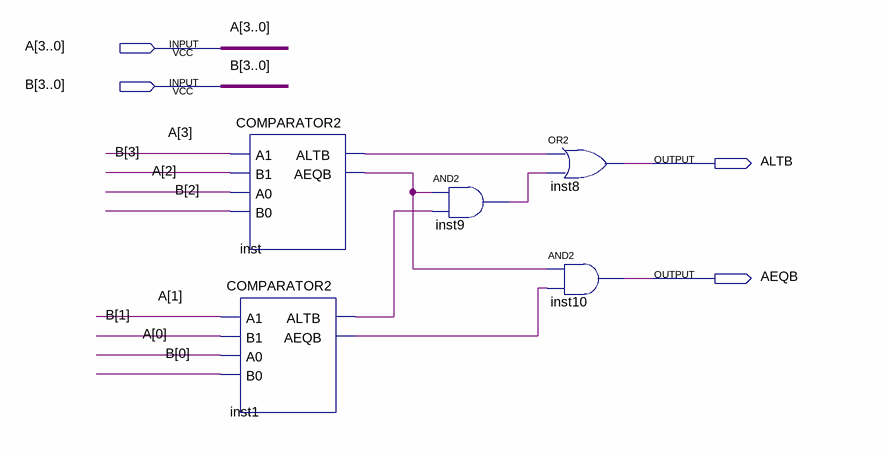
[diagram p0: schematic sheet]
// Quartus schematic COMPARATOR4-B.bdf as structural Verilog: 5 symbols, 4 pins
module \COMPARATOR4-B  (
  input  [3:0] A,
  input  [3:0] B,
  output ALTB,
  output AEQB
);

  wire inst1_aeqb, inst1_altb, inst9_out, inst_aeqb, inst_altb;

  COMPARATOR2 inst (.A1(A[3]), .B1(B[3]), .A0(A[2]), .B0(B[2]), .ALTB(inst_altb), .AEQB(inst_aeqb));
  COMPARATOR2 inst1 (.A1(A[1]), .B1(B[1]), .A0(A[0]), .B0(B[0]), .ALTB(inst1_altb), .AEQB(inst1_aeqb));
  and inst9 (inst9_out, inst_aeqb, inst1_altb);
  or inst8 (ALTB, inst_altb, inst9_out);
  and inst10 (AEQB, inst_aeqb, inst1_aeqb);
endmodule
